# EAGLE design power_control (EAGLE 5.12)

## Sheet 1 of 2
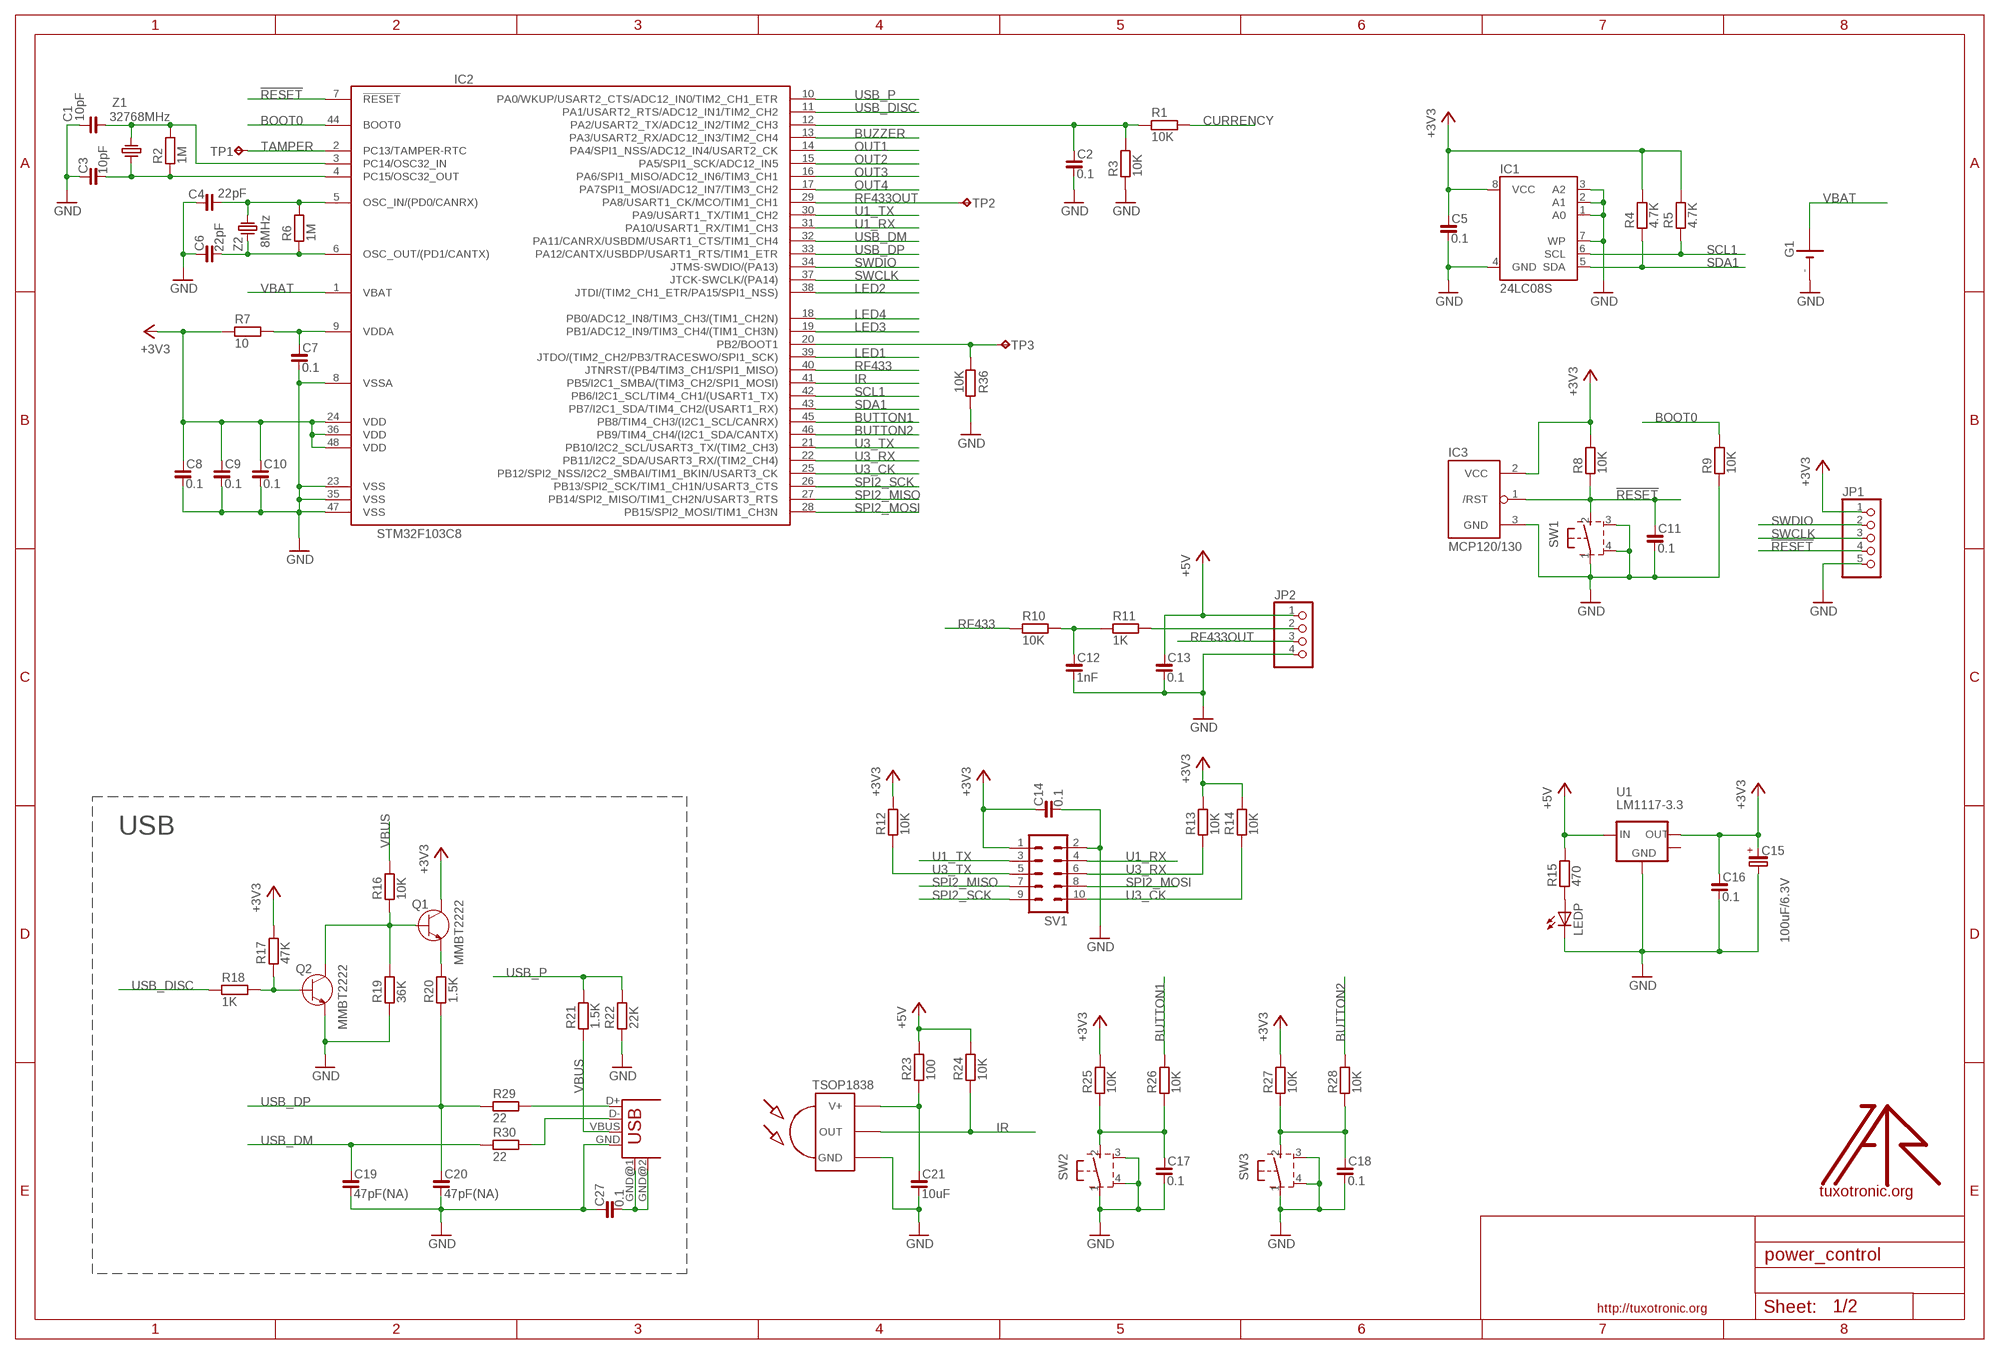
[diagram p0: schematic, sheet 1]

### Parts
C1  10pF  C_0603  [C0603]
C2  0.1  C_0603  [C0603]
C3  10pF  C_0603  [C0603]
C4  22pF  C_0603  [C0603]
C5  0.1  C_0603  [C0603]
C6  22pF  C_0603  [C0603]
C7  0.1  C_0603  [C0603]
C8  0.1  C_0603  [C0603]
C9  0.1  C_0603  [C0603]
C10  0.1  C_0603  [C0603]
C11  0.1  C_0603  [C0603]
C12  1nF  C_0603  [C0603]
C13  0.1  C_0603  [C0603]
C14  0.1  C_0603  [C0603]
C15  100uF/6.3V  CP_SMCD  [SMC_D]
C16  0.1  C_0805  [C0805]
C17  0.1  C_0603  [C0603]
C18  0.1  C_0603  [C0603]
C19  47pF(NA)  C_0603  [C0603]
C20  47pF(NA)  C_0603  [C0603]
C21  10uF  C_0603  [C0603]
C27  0.1  C_1206  [C1206]
G1  LI3VHOLDER  [LITHOLDER]
IC1  24LC08S  AT24C256S  [SO08]
IC2  STM32F103C8  [LQFP48]
IC3  MCP120/130  [SOT23]
IR1  TSOP1838  [TSOP18XX]
JP1  PINHD-1X5_2.00  [1X05M]
JP2  PINHD-1X4_2.54  [1X04]
LEDP  LEDCHIPLED_0805  [CHIPLED_0805]
Q1  MMBT2222  [SOT23]
Q2  MMBT2222  [SOT23]
R1  10K  R_0603  [R0603]
R2  1M  R_0603  [R0603]
R3  10K  R_0603  [R0603]
R4  4.7K  R_0603  [R0603]
R5  4.7K  R_0603  [R0603]
R6  1M  R_0603  [R0603]
R7  10  R_0603  [R0603]
R8  10K  R_0603  [R0603]
R9  10K  R_0603  [R0603]
R10  10K  R_0603  [R0603]
R11  1K  R_0603  [R0603]
R12  10K  R_0603  [R0603]
R13  10K  R_0603  [R0603]
R14  10K  R_0603  [R0603]
R15  470  R_0603  [R0603]
R16  10K  R_0603  [R0603]
R17  47K  R_0603  [R0603]
R18  1K  R_0603  [R0603]
R19  36K  R_0603  [R0603]
R20  1.5K  R_0603  [R0603]
R21  1.5K  R_0603  [R0603]
R22  22K  R_0603  [R0603]
R23  100  R_0603  [R0603]
R24  10K  R_0603  [R0603]
R25  10K  R_0603  [R0603]
R26  10K  R_0603  [R0603]
R27  10K  R_0603  [R0603]
R28  10K  R_0603  [R0603]
R29  22  R_0603  [R0603]
R30  22  R_0603  [R0603]
R36  10K  R_0603  [R0603]
SV1  ML10  [ML10]
SW1  31-XX  [B3F-31XX]
SW2  31-XX  [B3F-31XX]
SW3  31-XX  [B3F-31XX]
TP1  TPB1,27  [B1,27]
TP2  TPB1,27  [B1,27]
TP3  TPB1,27  [B1,27]
U1  LM1117-3.3  [SOT223]
U$1  LOGO  [TT_LOGO]
USB1  USB-B-H  [USB-B-H]
Z1  32768MHz  CRYSTAL-TC26H  [TC26H]
Z2  8MHz  CRYSTAL-HC49S  [HC49/S]

### Nets
!RESET: C11.1 IC2.7(!RESET) IC3.1(/RST) JP1.4 R8.1 SW1.2(S)
+3V3: C5.1 C8.1 C9.1 C10.1 C14.1 C15.+ C16.1 IC1.8(VCC) IC2.24(VDD) IC2.36(VDD) IC2.48(VDD) IC3.2(VCC) JP1.1 Q1.3(C) R4.2 R5.2 R7.1 R8.2 R12.2 R13.2 R14.2 R17.2 R25.2 R27.2 SV1.1 U1.2(OUT)
+5V: C13.1 JP2.1 R15.2 R23.2 R24.2 U1.3(IN) ; also sheet 2
BOOT0: IC2.44(BOOT0) R9.2
BUTTON1: IC2.45(PB8/TIM4_CH3/(I2C1_SCL/CANRX)) R26.2
BUTTON2: IC2.46(PB9/TIM4_CH4/(I2C1_SDA/CANTX)) R28.2
BUZZER: IC2.13(PA3/USART2_RX/ADC12_IN3/TIM2_CH4) ; also sheet 2
CURRENCY: R1.2 ; also sheet 2
GND: C1.1 C2.2 C3.1 C4.1 C5.2 C6.1 C7.2 C8.2 C9.2 C10.2 C11.2 C12.2 C13.2 C14.2 C15.- C16.2 C17.2 C18.2 C19.2 C20.2 C21.2 C27.1 G1.- IC1.1(A0) IC1.2(A1) IC1.3(A2) IC1.4(GND) IC1.7(WP) IC2.8(VSSA) IC2.23(VSS) IC2.35(VSS) IC2.47(VSS) IC3.3(GND) IR1.GND JP1.5 JP2.4 LEDP.C Q2.2(E) R3.1 R9.1 R19.1 R22.1 R36.2 SV1.2 SW1.1(P) SW1.3(GND1) SW1.4(GND2) SW2.1(P) SW2.3(GND1) SW2.4(GND2) SW3.1(P) SW3.3(GND1) SW3.4(GND2) U1.1(GND) USB1.GND ; also sheet 2
IR: IC2.41(PB5/I2C1_SMBA/(TIM3_CH2/SPI1_MOSI)) IR1.OUT R24.1
LED1: IC2.39(JTDO/(TIM2_CH2/PB3/TRACESWO/SPI1_SCK)) ; also sheet 2
LED2: IC2.38(JTDI/(TIM2_CH1_ETR/PA15/SPI1_NSS)) ; also sheet 2
LED3: IC2.19(PB1/ADC12_IN9/TIM3_CH4/(TIM1_CH3N)) ; also sheet 2
LED4: IC2.18(PB0/ADC12_IN8/TIM3_CH3/(TIM1_CH2N)) ; also sheet 2
N$1: IC2.20(PB2/BOOT1) R36.1 TP3.PP(TP)
N$7: C7.1 IC2.9(VDDA) R7.2
N$8: C3.2 IC2.4(PC15/OSC32_OUT) R2.1 Z1.1
N$9: C1.2 IC2.3(PC14/OSC32_IN) R2.2 Z1.2
N$16: C4.2 IC2.5(OSC_IN/(PD0/CANRX)) R6.2 Z2.2
N$28: C2.1 IC2.12(PA2/USART2_TX/ADC12_IN2/TIM2_CH3) R1.1 R3.2
N$29: C21.1 IR1.VCC(V+) R23.1
N$30: C27.2 USB1.GND@1(GND) USB1.GND@2(GND)
N$31: C17.1 R25.1 R26.1 SW2.2(S)
N$32: JP2.2 R11.2
N$33: C18.1 R27.1 R28.1 SW3.2(S)
N$34: C12.1 R10.2 R11.1
N$36: Q1.2(E) R20.2
N$37: Q1.1(B) Q2.3(C) R16.1 R19.2
N$38: Q2.1(B) R17.1 R18.2
N$39: R29.2 USB1.D+
N$40: R30.2 USB1.D-
N$46: LEDP.A R15.1
OUT1: IC2.14(PA4/SPI1_NSS/ADC12_IN4/USART2_CK) ; also sheet 2
OUT2: IC2.15(PA5/SPI1_SCK/ADC12_IN5) ; also sheet 2
OUT3: IC2.16(PA6/SPI1_MISO/ADC12_IN6/TIM3_CH1) ; also sheet 2
OUT4: IC2.17(PA7SPI1_MOSI/ADC12_IN7/TIM3_CH2) ; also sheet 2
RF433: IC2.40(JTNRST/(PB4/TIM3_CH1/SPI1_MISO)) R10.1
RF433OUT: IC2.29(PA8/USART1_CK/MCO/TIM1_CH1) JP2.3 TP2.PP(TP)
SCL1: IC1.6(SCL) IC2.42(PB6/I2C1_SCL/TIM4_CH1/(USART1_TX)) R5.1
SDA1: IC1.5(SDA) IC2.43(PB7/I2C1_SDA/TIM4_CH2/(USART1_RX)) R4.1
SPI2_MISO: IC2.27(PB14/SPI2_MISO/TIM1_CH2N/USART3_RTS) SV1.7
SPI2_MOSI: IC2.28(PB15/SPI2_MOSI/TIM1_CH3N) SV1.8
SPI2_SCK: IC2.26(PB13/SPI2_SCK/TIM1_CH1N/USART3_CTS) SV1.9
SWCLK: IC2.37(JTCK-SWCLK/(PA14)) JP1.3
SWDIO: IC2.34(JTMS-SWDIO/(PA13)) JP1.2
TAMPER: IC2.2(PC13/TAMPER-RTC) TP1.PP(TP)
U1_RX: IC2.31(PA10/USART1_RX/TIM1_CH3) SV1.4
U1_TX: IC2.30(PA9/USART1_TX/TIM1_CH2) SV1.3
U3_CK: IC2.25(PB12/SPI2_NSS/I2C2_SMBAI/TIM1_BKIN/USART3_CK) R14.1 SV1.10
U3_RX: IC2.22(PB11/I2C2_SDA/USART3_RX/(TIM2_CH4)) R13.1 SV1.6
U3_TX: IC2.21(PB10/I2C2_SCL/USART3_TX/(TIM2_CH3)) R12.1 SV1.5
USB_DISC: IC2.11(PA1/USART2_RTS/ADC12_IN1/TIM2_CH2) R18.1
USB_DM: C19.1 IC2.32(PA11/CANRX/USBDM/USART1_CTS/TIM1_CH4) R30.1
USB_DP: C20.1 IC2.33(PA12/CANTX/USBDP/USART1_RTS/TIM1_ETR) R20.1 R29.1
USB_P: IC2.10(PA0/WKUP/USART2_CTS/ADC12_IN0/TIM2_CH1_ETR) R21.2 R22.2
VBAT: G1.+ IC2.1(VBAT)
VBUS: R16.2 R21.1 USB1.VBUS
XTAL2: C6.2 IC2.6(OSC_OUT/(PD1/CANTX)) R6.1 Z2.1
Unconnected: U1.4(MASS)

### Notes on the sheet
- USB

## Sheet 2 of 2
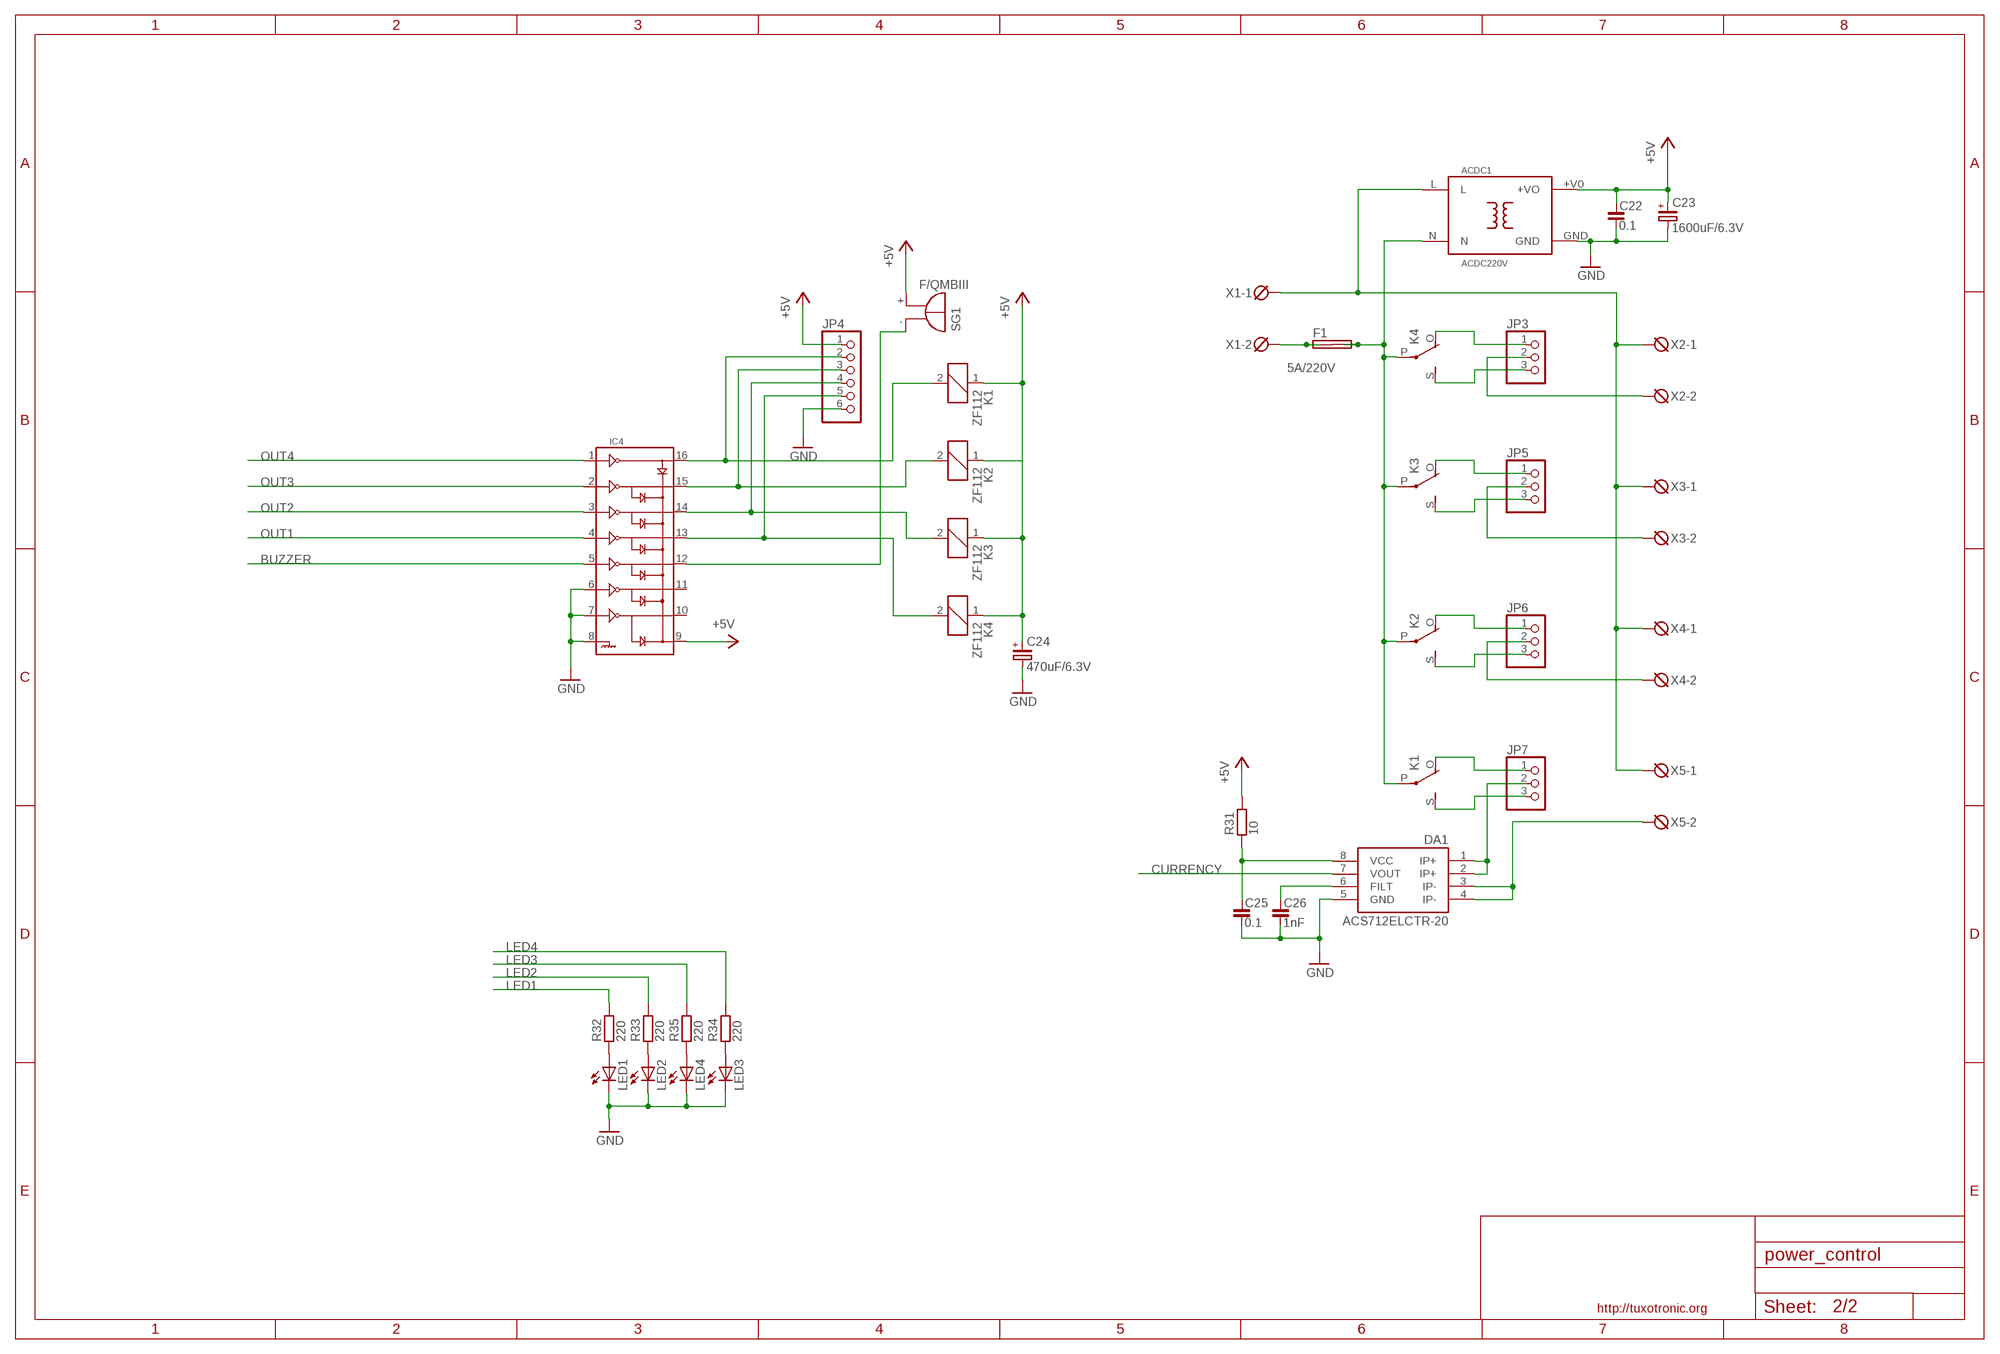
[diagram p1: schematic, sheet 2]

### Parts
ACDC1  ACDC220V  [ACDC600MA]
C22  0.1  C_0805  [C0805]
C23  1600uF/6.3V  CP_E-050X120  [CE-050X120]
C24  470uF/6.3V  CP_E-050X120  [CE-050X120]
C25  0.1  C_0603  [C0603]
C26  1nF  C_0603  [C0603]
DA1  ACS712ELCTR-20  ACS712  [SO08]
F1  5A/220V  SHK20L  [SHK20L]
IC4  ULN2003D  [SO16]
JP3  PINHD-1X3_2.54  [1X03]
JP4  PINHD-1X6_2.54  [1X06]
JP5  PINHD-1X3_2.54  [1X03]
JP6  PINHD-1X3_2.54  [1X03]
JP7  PINHD-1X3_2.54  [1X03]
K1  ZF112  [ZF112]
K2  ZF112  [ZF112]
K3  ZF112  [ZF112]
K4  ZF112  [ZF112]
LED1  LEDCHIPLED_0805  [CHIPLED_0805]
LED2  LEDCHIPLED_0805  [CHIPLED_0805]
LED3  LEDCHIPLED_0805  [CHIPLED_0805]
LED4  LEDCHIPLED_0805  [CHIPLED_0805]
R31  10  R_0603  [R0603]
R32  220  R_0603  [R0603]
R33  220  R_0603  [R0603]
R34  220  R_0603  [R0603]
R35  220  R_0603  [R0603]
SG1  F/QMBIII  [F/QMBIII]
X1  DG3XX-02-5.0  [DG306-5.0-02P]
X2  DG3XX-02-5.0  [DG306-5.0-02P]
X3  DG3XX-02-5.0  [DG306-5.0-02P]
X4  DG3XX-02-5.0  [DG306-5.0-02P]
X5  DG3XX-02-5.0  [DG306-5.0-02P]

### Nets
+5V: ACDC1.+V0(+VO) C22.1 C23.+ C24.+ IC4.9 JP4.1 K1.1 K2.1 K3.1 K4.1 R31.2 SG1.+(-) ; also sheet 1
BUZZER: IC4.5 ; also sheet 1
CURRENCY: DA1.7(VOUT) ; also sheet 1
GND: ACDC1.GND C22.2 C23.- C24.- C25.2 C26.2 DA1.5(GND) IC4.6 IC4.7 IC4.8 JP4.6 LED1.C LED2.C LED3.C LED4.C ; also sheet 1
LED1: R32.2 ; also sheet 1
LED2: R33.2 ; also sheet 1
LED3: R35.2 ; also sheet 1
LED4: R34.2 ; also sheet 1
N$2: LED1.A R32.1
N$3: F1.1A F1.1B X1.2
N$4: JP3.1 K4.O(2:O)
N$5: JP3.3 K4.S(2:S)
N$6: JP5.1 K3.O(2:O)
N$10: IC4.13 JP4.5 K4.2
N$11: IC4.14 JP4.4 K3.2
N$12: IC4.15 JP4.3 K2.2
N$13: JP5.3 K3.S(2:S)
N$14: JP6.1 K2.O(2:O)
N$15: JP6.3 K2.S(2:S)
N$17: JP7.1 K1.O(2:O)
N$18: JP7.3 K1.S(2:S)
N$19: DA1.3(IP-) DA1.4(IP-) X5.2
N$20: JP6.2 X4.2
N$21: JP5.2 X3.2
N$22: JP3.2 X2.2
N$23: DA1.1(IP+) DA1.2(IP+) JP7.2
N$24: C26.1 DA1.6(FILT)
N$25: C25.1 DA1.8(VCC) R31.1
N$26: IC4.16 JP4.2 K1.2
N$27: IC4.12 SG1.-(+)
N$35: ACDC1.N F1.2A F1.2B K1.P(2:P) K2.P(2:P) K3.P(2:P) K4.P(2:P)
N$41: ACDC1.L X1.1 X2.1 X3.1 X4.1 X5.1
N$43: LED2.A R33.1
N$44: LED3.A R34.1
N$45: LED4.A R35.1
OUT1: IC4.4 ; also sheet 1
OUT2: IC4.3 ; also sheet 1
OUT3: IC4.2 ; also sheet 1
OUT4: IC4.1 ; also sheet 1
Unconnected: IC4.10 IC4.11

## Library data of the parts
ACDC1 = dcdc-isolated:ACDC220V: input Input Voltage: AC86 ~ 264V Frequency: 47 ~ 440Hz Impact of current: 16A/AC220V Output Output voltage: 5V, linear adjustment >1% Out current: 0.6A Output voltage (mVP-P): Ripple and noise <1% Temperature coefficient: +-0.2% maintain time 20ms
C1-C14 C16-C22 C25-C27 = rc-master-smd:C_: NON-POLARIZED CAP
C15 = rc-master-smd:CP_: POLARIZED CAP
C23 C24 = rc-master:CP_: POLARIZED CAP
DA1 = SparkFun:ACS712
F1 = fuse:SHK20L: FUSE HOLDER 5 x 20 mm, SH contact, SHH1 Schukat, E1073 Buerklin
G1 = battery:LI3VHOLDER
IC1 = stm32-by-pb:AT24C*: 2-wire serial EEPROM
IC2 = stm32:STM32F103C
IC3 = mcp120-130:MCP120/130
IC4 = transistor-arrays:ULN2003: OUTPUT CURRENT 500mA PER DRIVER (600mA PEAK) OUTPUT VOLTAGE 50V
IR1 = tsop-1:TSOP1838: IR Receiver and Demodulator
JP1 = pinhead-fixdrills:PINHD-1X5: PIN HEADER
JP2 = pinhead-fixdrills:PINHD-1X4: PIN HEADER
JP3 JP5-JP7 = pinhead-fixdrills:PINHD-1X3: PIN HEADER
JP4 = pinhead-fixdrills:PINHD-1X6: PIN HEADER
K1-K4 = myrelays:ZF112: RELAY 1 x switch
LED1-LED4 LEDP = led:LED: LED OSRAM: - CHIPLED LG R971, LG N971, LY N971, LG Q971, LY Q971, LO R971, LY R971 LH N974, LH R974 LS Q976, LO Q976, LY Q976 LO Q996 - Hyper CHIPLED LW Q18S LB Q993, LB Q99A, LB R99A - SideLED LS A670, LO A670, LY A670, LG A670, LP A670 LB A673, LV A673, LT A673, LW A673 LH A674 LY A675 LS A676, LA A676, LO A676, LY A676, LW A676 LS A679, LY A679, LG A679 - Hyper Micro SIDELED® LS Y876, LA Y876, LO Y876, LY Y876 LT Y87S - SmartLED LW L88C, LW L88S LB L89C, LB L89S, LG L890 LS L89K, LO L89K, LY L89K LS L896, LA L896, LO L896, LY L896 - TOPLED LS T670, LO T670, LY T670, LG T670, LP T670 LSG T670, LSP T670, LSY T670, LOP T670, LYG T670 LG T671, LOG T671, LSG T671 LB T673, LV T673, LT T673, LW T673 LH T674 LS T676, LA T676, LO T676, LY T676, LB T676, LH T676, LSB T676, LW T676 LB T67C, LV T67C, LT T67C, LS T67K, LO T67K, LY T67K, LW E67C LS E67B, LA E67B, LO E67B, LY E67B, LB E67C, LV E67C, LT E67C LW T67C LS T679, LY T679, LG T679 LS T770, LO T770, LY T770, LG T770, LP T770 LB T773, LV T773, LT T773, LW T773 LH T774 LS E675, LA E675, LY E675, LS T675 LS T776, LA T776, LO T776, LY T776, LB T776 LHGB T686 LT T68C, LB T68C - Hyper Mini TOPLED® LB M676 - Mini TOPLED Santana® LG M470 LS M47K, LO M47K, LY M47K Source: http://www.osram.convergy.de - LUMILED® LXK2-PW12-R00, LXK2-PW12-S00, LXK2-PW14-U00, LXK2-PW14-V00 LXK2-PM12-R00, LXK2-PM12-S00, LXK2-PM14-U00 LXK2-PE12-Q00, LXK2-PE12-R00, LXK2-PE12-S00, LXK2-PE14-T00, LXK2-PE14-U00 LXK2-PB12-K00, LXK2-PB12-L00, LXK2-PB12-M00, LXK2-PB14-N00, LXK2-PB14-P00, LXK2-PB14-Q00 LXK2-PR12-L00, LXK2-PR12-M00, LXK2-PR14-Q00, LXK2-PR14-R00 LXK2-PD12-Q00, LXK2-PD12-R00, LXK2-PD12-S00 LXK2-PH12-R00, LXK2-PH12-S00 LXK2-PL12-P00, LXK2-PL12-Q00, LXK2-PL12-R00 Source: www.luxeon.com
Q1 Q2 = semiconductor:MMBT2222: General Purpose Transistors NPN Silicon Rating MMBT2222LT1G MMBT2222ALT1G Collector-Emitter Voltage (VCEO) 30 Vdc 40 Vdc Collector-Base Voltage (VCBO) 60 Vdc 75 Vdc Emitter-Base Voltage (VEBO) 5.0 Vdc 6.0 Vdc Collector Current Continuous (IC) 600 mAdc 1100 mAdc Collector Current Peak (ICM) 600 mAdc 1100 mAdc
R1-R36 = rc-master-smd:R_: RESISTOR
SG1 = buzzer:F/QMBIII: BUZZER Source: Buerklin
SV1 = con-ml:ML10: HARTING
SW1-SW3 = buttons:31-XX: OMRON SWITCH
TP1-TP3 = testpad:TP: Test pad
U1 = vreg-linear:LM1117: Linear regulators
U$1 = logo:LOGO
USB1 = usb:USB: USB Connectors
X1-X5 = degson:DG3XX-02: DG350-3.5-02P DG306-5.0-02P
Z1 Z2 = discrete:CRYSTAL-: CRYSTAL

## Board
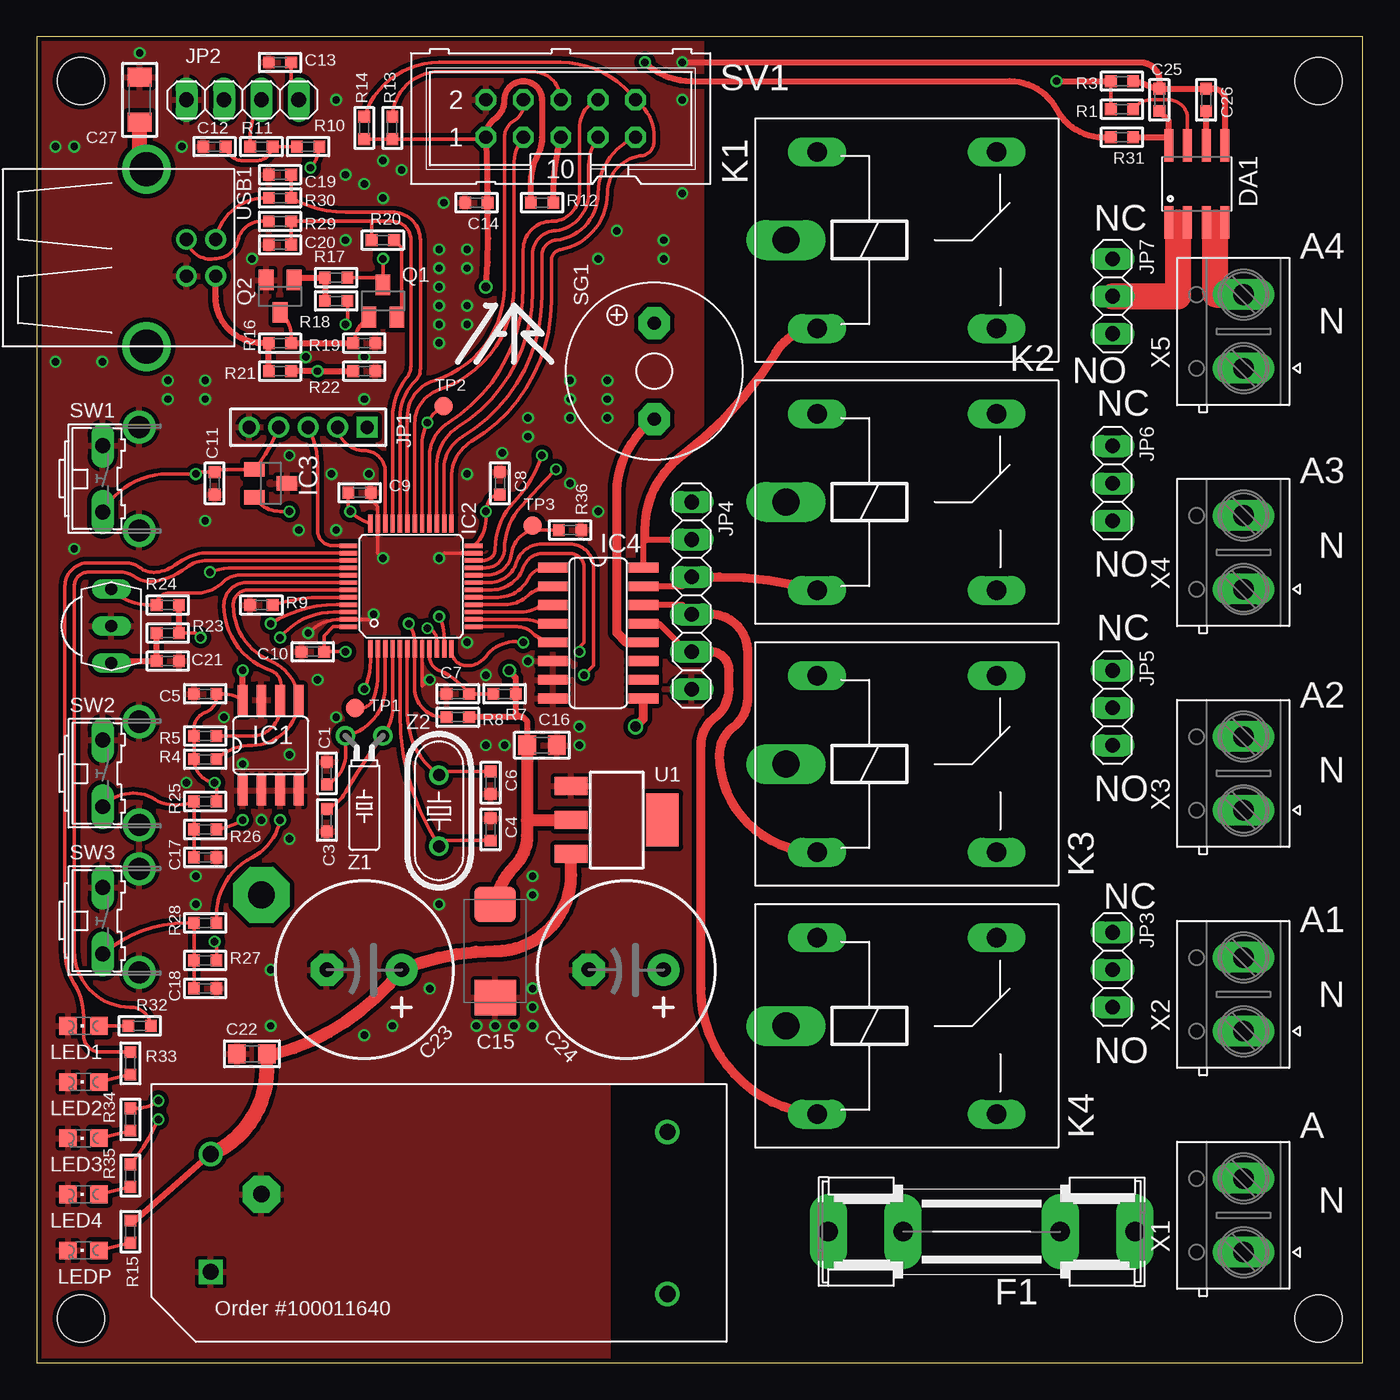
[diagram p2: board, top side]
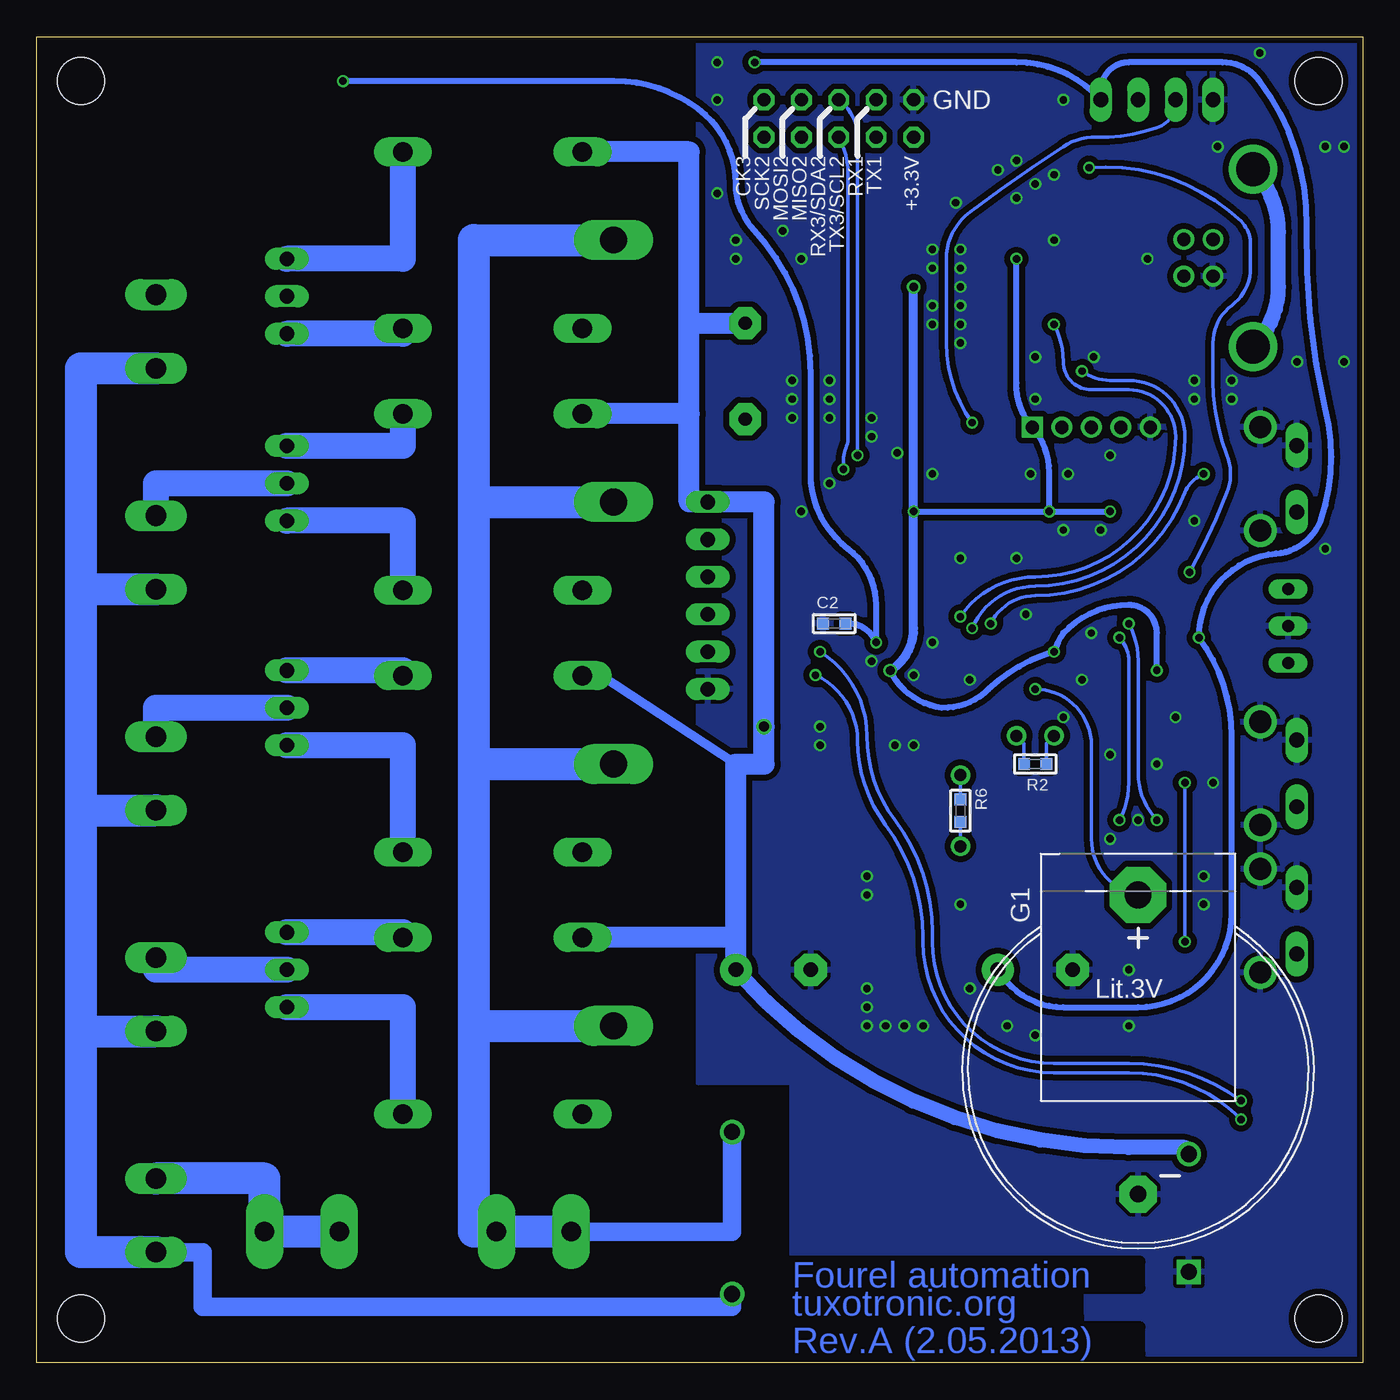
[diagram p3: board, bottom side, seen from below]

Size 90 x 90 mm. Coordinates in mm from the lower left corner, seen from the top.
Outline: 0,0 90,0 90,90 0,90 0,0
Copper layers (1*16): Top 0.035mm / dielectric 1.5mm / Bottom 0.035mm
Design rules "ITEADstudio_DRC": minimum track width 6mil, minimum drill 12mil, track to track 6mil, track to pad 6mil, pad to pad 6mil, via to via 6mil, smd to smd 0mil, copper to edge 10mil, drill to drill 10mil, minimum pad ring 10mil, minimum via ring 6mil, stop-mask expansion 2mil, vias tented up to drill 100mil, thermal gap 10mil
Holes 3.2 mm at 87,3 3,3 3,87 87,87

### Footprints (pad centres in the part's own frame; a part is rotated, then mirrored left to right if it is on the bottom)
ACDC600MA = drill 1.1 round: +V0 -15.5,4; L 15.5,-5.5; N 15.5,5.5 | drill 1.1 square: GND -15.5,-4
C0603 = smd 0.8 x 0.8: 1 -0.762,0; 2 0.762,0
SMC_D = smd 2.4 x 2.8: + -3.15,0; - 3.15,0
C0805 = smd 1.2 x 1.3: 1 -1.016,0; 2 1.016,0
CE-050X120 = drill 1 pad 2.184 round: + -2.54,0 | drill 1 pad 2.184 octagon: - 2.54,0
C1206 = smd 1.3 x 1.6: 1 -1.524,0; 2 1.524,0
SO08 = smd 0.61 x 2.21: 1 -1.905,-2.616; 2 -0.635,-2.616; 3 0.635,-2.616; 4 1.905,-2.616; 5 1.905,2.616; 6 0.635,2.616; 7 -0.635,2.616; 8 -1.905,2.616
SHK20L = drill 1.321 pad 2.54 long: 1A -10.414,0; 1B -5.334,0; 2A 10.414,0; 2B 5.334,0
LITHOLDER = drill 1.803 pad 3.81 octagon: + 0,12.065 | drill 1.118 pad 2.54 octagon: - 0,-8.255
SO08' = smd 0.66 x 2.032: 1 -1.905,-3.073; 2 -0.635,-3.073; 3 0.635,-3.073; 4 1.905,-3.073; 5 1.905,3.073; 6 0.635,3.073; 7 -0.635,3.073; 8 -1.905,3.073
LQFP48 = smd 0.3 x 1.2: 1 -2.75,-4.25; 2 -2.25,-4.25; 3 -1.75,-4.25; 4 -1.25,-4.25; 5 -0.75,-4.25; 6 -0.25,-4.25; 7 0.25,-4.25; 8 0.75,-4.25; 9 1.25,-4.25; 10 1.75,-4.25; 11 2.25,-4.25; 12 2.75,-4.25; 25 2.75,4.25; 26 2.25,4.25; 27 1.75,4.25; 28 1.25,4.25; 29 0.75,4.25; 30 0.25,4.25; 31 -0.25,4.25; 32 -0.75,4.25; 33 -1.25,4.25; 34 -1.75,4.25; 35 -2.25,4.25; 36 -2.75,4.25 | smd 1.2 x 0.3: 13 4.25,-2.75; 14 4.25,-2.25; 15 4.25,-1.75; 16 4.25,-1.25; 17 4.25,-0.75; 18 4.25,-0.25; 19 4.25,0.25; 20 4.25,0.75; 21 4.25,1.25; 22 4.25,1.75; 23 4.25,2.25; 24 4.25,2.75; 37 -4.25,2.75; 38 -4.25,2.25; 39 -4.25,1.75; 40 -4.25,1.25; 41 -4.25,0.75; 42 -4.25,0.25; 43 -4.25,-0.25; 44 -4.25,-0.75; 45 -4.25,-1.25; 46 -4.25,-1.75; 47 -4.25,-2.25; 48 -4.25,-2.75
SOT23 = smd 1 x 1.4: 1 -0.95,-1.1; 2 0.95,-1.1; 3 0,1.1
SO16 = smd 0.66 x 2.032: 1 -4.445,-3.073; 2 -3.175,-3.073; 3 -1.905,-3.073; 4 -0.635,-3.073; 5 0.635,-3.073; 6 1.905,-3.073; 7 3.175,-3.073; 8 4.445,-3.073; 9 4.445,3.073; 10 3.175,3.073; 11 1.905,3.073; 12 0.635,3.073; 13 -0.635,3.073; 14 -1.905,3.073; 15 -3.175,3.073; 16 -4.445,3.073
TSOP18XX = drill 0.813 long: GND -0.001,-0.027; OUT -2.501,-0.027; VCC 2.499,-0.027
1X05M = drill 0.9 square: 1 -4,0 | drill 0.9 round: 2 -2,0; 3 0,0; 4 2,0; 5 4,0
1X04 = drill 1 long: 1 -3.81,0; 2 -1.27,0; 3 1.27,0; 4 3.81,0
1X03 = drill 1 long: 1 -2.54,0; 2 0,0; 3 2.54,0
1X06 = drill 1 long: 1 -6.35,0; 2 -3.81,0; 3 -1.27,0; 4 1.27,0; 5 3.81,0; 6 6.35,0
ZF112 = drill 1.321 long: 1 -6.096,5.994; 2 -6.096,-5.994; O 6.096,5.994; S 6.096,-5.994 | drill 1.803 long: P -8.204,0
CHIPLED_0805 = smd 1.2 x 1.2: A 0,-1.05; C 0,1.05
R0603 = smd 0.8 x 0.8: 1 -0.762,0; 2 0.762,0
F/QMBIII = drill 0.9 pad 2.159 octagon: + 3.251,0; - -3.251,0
ML10 = drill 0.9 octagon: 1 -5.08,-1.27; 2 -5.08,1.27; 3 -2.54,-1.27; 4 -2.54,1.27; 5 0,-1.27; 6 0,1.27; 7 2.54,-1.27; 8 2.54,1.27; 9 5.08,-1.27; 10 5.08,1.27
B3F-31XX = drill 1.016 long: 1 -2.261,-1.245; 2 2.261,-1.245 | drill 1.499 pad 2.159 round: 3 -3.505,1.245; 4 3.505,1.245
B1,27 = smd 1.27 x 1.27: PP 0,0
SOT223 = smd 1.219 x 2.235: 1 -2.311,-3.099; 2 0,-3.099; 3 2.311,-3.099 | smd 3.6 x 2.2: 4 0,3.099
USB-B-H = drill 0.9 round: D+ 0,1.25; D- 1.981,1.25; GND 0,-1.25; VBUS 1.981,-1.25 | drill 2.3 round: GND@1 -2.718,6.02; GND@2 -2.718,-6.02
DG306-5.0-02P = drill 1.4 long: 1 -2.5,0; 2 2.5,0
TC26H = drill 0.813 round: 1 -1.27,0; 2 1.27,0
HC49/S = drill 0.813 round: 1 -2.413,0; 2 2.413,0

### Placement (x,y rotation side)
ACDC1  27.3,10.16 0 top
C1  19.68,40.01 270 top
C2  35.88,50.16 180 bottom
C3  19.68,36.83 90 top
C4  30.8,36.2 270 top
C5  11.43,45.4 180 top
C6  30.8,39.37 90 top
C7  28.57,45.4 180 top
C8  31.43,59.69 90 top
C9  21.91,59.05 0 top
C10  18.73,48.26 180 top
C11  12.06,59.69 270 top
C12  12.06,82.55 180 top
C13  16.51,88.27 180 top
C14  29.84,78.74 180 top
C15  31.11,27.94 270 top
C16  34.29,41.91 0 top
C17  11.43,34.29 0 top
C18  11.43,25.4 0 top
C19  16.51,80.64 180 top
C20  16.51,75.88 180 top
C21  8.89,47.62 0 top
C22  14.61,20.95 180 top
C23  22.23,26.67 180 top
C24  40.01,26.67 180 top
C25  76.2,85.72 90 top
C26  79.38,85.72 90 top
C27  6.99,85.72 270 top
DA1  78.74,80.01 0 top
F1  64.14,8.89 180 top
G1  15.24,19.68 0 bottom
IC1  24LC08S  [SO08']  15.88,41.91 0 top
IC2  25.4,52.7 0 top
IC3  15.88,59.69 270 top
IC4  38.1,49.53 270 top
IR1  5.08,50 270 top
JP1  18.41,63.5 180 top
JP2  13.97,85.72 180 top
JP3  73.03,26.67 270 top
JP4  44.45,52.07 270 top
JP5  73.03,44.45 270 top
JP6  73.03,59.69 270 top
JP7  73.03,72.39 270 top
K1  59.05,76.2 0 top
K2  59.05,58.42 0 top
K3  59.05,40.64 0 top
K4  59.05,22.86 0 top
LED1  3.17,22.86 90 top
LED2  3.17,19.05 90 top
LED3  3.17,15.24 90 top
LED4  3.17,11.43 90 top
LEDP  3.17,7.62 90 top
Q1  23.5,72.07 0 top
Q2  16.51,72.39 180 top
R1  73.66,85.09 0 top
R2  22.23,40.64 0 bottom
R3  73.66,87 180 top
R4  11.43,40.96 180 top
R5  11.43,42.55 180 top
R6  27.3,37.47 270 bottom
R7  31.75,45.4 180 top
R8  28.57,43.81 0 top
R9  15.24,51.44 0 top
R10  18.41,82.55 180 top
R11  15.24,82.55 180 top
R12  34.29,78.74 180 top
R13  24.13,83.82 270 top
R14  22.23,83.82 270 top
R15  6.35,8.89 90 top
R16  16.51,69.22 180 top
R17  20.32,73.66 0 top
R18  20.32,72.07 180 top
R19  22.23,69.22 180 top
R20  23.5,76.2 0 top
R21  16.51,67.31 0 top
R22  22.23,67.31 180 top
R23  8.89,49.53 0 top
R24  8.89,51.44 0 top
R25  11.43,38.1 0 top
R26  11.43,36.2 0 top
R27  11.43,27.3 0 top
R28  11.43,29.84 0 top
R29  16.51,77.47 180 top
R30  16.51,79.06 180 top
R31  73.66,83.19 180 top
R32  6.99,22.86 0 top
R33  6.35,20.32 90 top
R34  6.35,16.51 90 top
R35  6.35,12.7 90 top
R36  36.2,56.52 0 top
SG1  41.91,67.31 90 top
SV1  35.56,84.45 0 top
SW1  5.71,60 270 top
SW2  5.71,40 270 top
SW3  5.71,30 270 top
TP1  21.59,44.45 0 top
TP2  27.62,64.93 0 top
TP3  33.66,56.83 0 top
U1  39.37,36.83 270 top
U$1  32.38,70.48 0 top
USB1  10.16,75 0 top
X1  81.92,10 90 top
X2  81.92,25 90 top
X3  81.92,40 90 top
X4  81.92,55 90 top
X5  81.92,70 90 top
Z1  22.23,42.55 180 top
Z2  27.3,37.47 270 top

### Tracks (layer width: path | path; a pad name or v marks a point on that pad's centre or on a via)
!RESET  (via drill 0.5)
  Top 0.254: JP1.4 16.1,62.77 arc-17 IC3.1 12.06,60.64 C11.1 10.92,60.45 v10.79,60.33 8.89,60.33 arc61 SW1.2 | R8.1 27.62,43.81 arc-90 25.65,45.79 IC2.7 25.65,48.96 arc38 v25.24,50.16
  Bottom 0.254: v10.79,60.33 arc-48 12.06,59.05 arc69 22.23,52.07 arc-65 v25.24,50.16
+3V3  (via drill 0.5, 0.6)
  Top 0.254: R14.2 R13.2 30.35,83.06 SV1.1 | R27.2 12.19,28.45 v12.06,28.57 | R25.2 12.19,39.24 v12.06,39.37 arc-83 R4.2 R5.2 10.67,43.05 arc-70 11.43,44.13 arc79 C5.1 12.6,45.4 arc-34 IC1.8 | C9.1 21.14,57.91 v21.27,57.78 arc28 IC2.36 | IC2.48 20.11,49.95 19.49,49.34 C10.1 v20.95,48.26 | v23.5,74.93 Q1.3 23.01,73.66 R17.2 | v17.14,57.78 16.51,57.78 arc-58 IC3.2 | C8.1 arc77 30.61,58.29 v30.48,57.78 30.48,57.15 arc-52 IC2.24
  Top 0.406: R12.2 33.53,80.2 arc-27 33.97,81.92 arc28 34.29,83.19 34.29,85.72 arc90 33.02,87 arc90 31.75,85.72 arc-53 31.11,84.45 arc53 SV1.1 arc-4 30.61,79.5 C14.1 30.61,77.98 arc-8 v30.48,73.03 | v32.07,46.99 32.51,46.48 R7.1 32.51,44.01 33.02,43.81 | 33.02,43.81 R8.2 | C16.1 33.27,43.56 33.02,43.81 | IC1.8 v13.97,46.99
  Top 0.813: C16.1 33.27,36.83 | 33.27,36.83 U1.2 | 33.27,36.83 33.27,35.77 arc-46 32.38,33.66 arc38 C15.+
  Bottom 0.254: v12.06,28.57 v12.06,39.37
  Bottom 0.406: v21.27,57.78 v17.14,57.78 | v21.27,57.78 21.27,60.45 arc-41 JP1.1 arc43 23.5,66.52 v23.5,74.93 | v30.48,57.78 v21.27,57.78 | v13.97,46.99 13.97,49.53 arc-90 15.88,51.44 arc-46 20.32,49.53 arc-13 v20.95,48.26 arc-27 25.4,45.72 arc46 28.57,44.45 arc57 v32.07,46.99
  Bottom 0.61: v30.48,73.03 v30.48,57.78 30.48,49.85 arc58 v32.07,46.99
+5V  (via drill 0.5, 0.7)
  Top 0.254: C13.1 17.27,86.23 JP2.1 | R23.2 10.79,49.53 v11.11,49.21
  Top 0.406: R23.2 R24.2 | R15.2 6.66,9.65 ACDC1.+V0 | R31.2 72.39,83.19 arc-62 69.22,85.09 arc62 66.04,87 44.45,87 arc-44 v41.27,88.27
  Top 0.61: IC4.9 41.17,43.71 v40.64,43.18
  Top 0.813: 15.62,19.94 C22.1 16.19,20.95 arc36 C23.+ arc-23 31.11,27.94 arc90 36.27,33.1 U1.3
  Top 1.016: ACDC1.+V0 arc67 15.62,19.94
  Bottom 0.406: v41.27,88.27 23.5,88.27 arc48 JP2.1 17.78,86.36 arc90 15.88,88.27 9.53,88.27 arc53 6.99,87 arc38 3.81,77.15 arc-14 2.54,64.77 arc34 2.86,57.15 arc64 5.87,54.93 arc-86 v11.11,49.21 arc37 8.89,42.55 8.89,30.48 arc90 15.24,24.13 20.32,24.13 arc59 C23.+
  Bottom 0.61: K3.1 51.71,46.63 42.55,40.64
  Bottom 1.016: ACDC1.+V0 11.8,14.35 12.06,14.61 15.88,14.61 arc49 C24.+
  Bottom 1.422: K1.1 45.72,82.19 45.72,70.56 | 45.72,70.56 SG1.+ | 45.72,64.41 45.72,70.56 | 45.72,64.41 K2.1 | 42.55,28.85 K4.1 | C24.+ 42.55,28.85 | 45.72,64.41 45.72,58.42 JP4.1 40.64,58.42 v40.64,43.18 40.64,40.64 42.55,40.64 42.55,28.85
BOOT0
  Top 0.254: IC2.44 19.57,51.95 arc17 R9.2
BUTTON1  (via drill 0.5)
  Top 0.254: IC2.45 20.34,51.45 arc32 v15.88,50.16 | R26.2 arc24 v13.97,36.83
  Bottom 0.254: v15.88,50.16 arc28 15.24,47.62 15.24,40.01 arc-44 v13.97,36.83
BUTTON2  (via drill 0.5)
  Top 0.254: R28.2 12.19,30.35 arc-63 14.61,34.29 arc52 v16.51,36.83 | IC2.46 20.16,50.95 arc51 v16.51,49.21
  Bottom 0.254: v16.51,49.21 arc44 15.88,47.62 15.88,39.37 arc28 v16.51,36.83
BUZZER
  Top 0.254: IC2.13 32.59,49.95 arc-44 33.66,49.53 arc38 IC4.5
CURRENCY
  Top 0.254: DA1.7 78.11,84.45 arc90 76.83,85.72 75.69,85.72 arc53 R1.2
GND  (via drill 0.5)
  Top 0.254: C9.2 22.67,58.61 23.15,58.13 IC2.35 23.15,54.95 v23.5,54.61 | v18.41,49.53 arc-46 20.61,50.45 | IC2.8 26.15,45.92 v26.67,46.35 | IC2.23 27.65,54.95 v27.3,54.61 | IC2.47 22.52,50.45 v22.86,50.8
  Top 0.406: DA1.5 80.64,85.72 arc90 79.88,86.49 C26.2 C25.2 | C25.2 76.2,87 arc90 74.93,88.27 v43.81,88.27 | R3.1 74.61,87 75.91,86.49 C25.2
  other vias: 20.95,76.2 20.95,80.64 20,60.33 22.23,65.41 31.59,61.75 29.21,48.9 19.05,46.35 17.14,35.56 20.32,43.81 17.14,41.27 15.24,36.83 10.79,33.02 13.97,40.64 10.16,39.37 10.79,31.11 22.54,60.33 20.32,56.52 12.7,43.81 27.62,78.74 43.81,85.72 42.55,76.2 42.55,74.93 39.37,76.83 30.48,46.67 33.34,47.62 31.75,41.91 30.48,41.91 36.83,41.91 36.83,43.18 33.66,33.02 38.1,57.78 36.2,59.69 38.73,64.14 36.2,64.14 33.34,64.14 33.34,62.87 27.3,69.22 29.21,60.33 20.32,85.72 14.61,74.93 38.73,65.41 38.73,66.67 36.2,65.41 36.2,66.67 43.81,79.38 33.66,31.75 27.3,31.11 26.67,25.4 33.66,25.4 33.66,24.13 33.66,22.86 32.38,22.86 31.11,22.86 29.84,22.86 24.13,22.86 22.23,22.23 15.88,22.86 15.88,26.67 38.1,74.93 27.3,70.48 27.3,71.75 27.3,73.03 27.3,74.3 27.3,75.56 29.21,70.48 29.21,71.75 29.21,74.3 29.21,75.56 22.23,80.01 23.5,79.06 24.77,80.96 23.5,81.6 8.89,66.67 8.89,65.41 11.43,66.67 11.43,65.41 11.43,57.15 17.78,56.52 17.14,61.59 18.26,68.26 22.23,68.26 9.84,82.55 2.54,82.55 1.27,82.55 6.99,88.9 1.27,67.94 4.45,67.94 2.54,55.24
  pour Bottom (isolate 0.406): -1.27,91.44 45.09,91.44 45.09,19.05 38.73,19.05 38.73,-0.64 -1.27,-0.64
  pour Top (isolate 0.305): -1.27,91.44 45.09,91.44 45.09,19.05 38.73,19.05 38.73,-0.64 -1.27,-0.64
IR
  Top 0.254: IC2.41 13.77,53.45 arc44 12.7,53.02 arc-46 10.64,52.23 arc4 8.89,52.23 arc88 R24.1 7.62,51.44 arc-45 IR1.OUT
LED1
  Top 0.254: IC2.39 11.59,54.45 arc37 10.16,53.98 arc-34 7.78,53.02 arc-42 6.67,53.34 arc37 5.71,53.66 3.49,53.66 arc90 2.54,52.7 2.54,27.94 arc90 6.35,24.13 arc-85 R32.2
LED2
  Top 0.254: IC2.38 11.46,54.95 arc30 10.16,54.61 arc10 9.37,54.13 arc-31 8.1,53.66 arc-42 6.99,53.98 arc37 6.03,54.29 3.49,54.29 arc90 1.91,52.7 1.91,27.94 arc32 2.54,25.72 arc-32 3.17,23.5 3.17,22.23 arc90 4.32,21.08 R33.2
LED3  (via drill 0.5)
  Top 0.254: IC2.19 30.73,52.95 arc73 32.54,54.29 arc-74 34.29,55.56 36.2,55.56 arc-90 37.78,53.98 37.78,47.31 v37.15,46.67 | v8.26,16.51 7.94,15.88 arc-14 R35.2
  Bottom 0.254: v8.26,16.51 arc-45 15.88,19.68 20.95,19.68 arc90 29.84,28.57 29.84,28.89 arc-37 32.38,36.51 arc37 34.29,42.23 arc-65 v37.15,46.67
LED4  (via drill 0.5)
  Top 0.254: IC2.18 30.86,52.45 arc70 33.02,53.98 arc-67 34.29,54.93 36.2,54.93 arc-90 37.15,53.98 37.15,48.9 36.83,48.58 v36.83,48.26 | R34.2 arc44 v8.26,17.78
  Bottom 0.254: v8.26,17.78 arc-37 15.88,20.32 20.95,20.32 arc90 29.21,28.57 29.21,29.21 arc-37 31.75,36.83 arc37 33.66,42.55 arc-58 v36.83,48.26
N$1
  Top 0.254: IC2.20 30.59,53.45 arc84 32.23,54.93 arc-84 33.97,56.52 | 33.97,56.52 arc-1 R36.1 | 33.97,56.52 TP3.PP
N$2
  Top 0.254: LED1.A R32.1
N$3
  Bottom 2.184: F1.1B F1.1A 74.55,12.5 X1.2
N$4
  Bottom 1.778: JP3.1 65.15,29.21 K4.O
N$5
  Bottom 1.778: JP3.3 65.15,24.13 K4.S
N$6
  Bottom 1.778: JP5.1 65.15,46.99 K3.O
N$7
  Top 0.254: R7.2 C7.1 arc32 27.3,46.99 arc-68 26.65,47.96 IC2.9
N$8
  Top 0.254: IC2.4 24.15,44.47 arc-38 Z1.1 arc8 20.95,38.73 arc-36 C3.2
  Bottom 0.254: R2.1 22.99,42.04 Z1.1
N$9
  Top 0.254: IC2.3 23.65,45.88 arc-78 Z1.2 20.95,41.27 arc-64 C1.2
  Bottom 0.254: R2.2 21.46,42.04 Z1.2
N$10
  Top 0.406: IC4.13 42.23,50.16 44.13,48.26 JP4.5
  Top 0.61: JP4.5 45.72,48.26 arc-90 46.99,46.99 46.99,45.72 arc-53 46.04,43.81 arc53 45.09,41.91 45.09,25.4 arc85 K4.2
N$11
  Top 0.406: IC4.14 43.81,51.44 JP4.4
  Top 0.61: JP4.4 45.72,50.8 arc-90 48.26,48.26 48.26,45.09 arc-53 47.31,43.18 arc53 46.35,41.27 arc90 K3.2
N$12
  Top 0.406: IC4.15 43.81,52.7 JP4.3
  Top 0.61: JP4.3 46.33,53.34 arc-16 K2.2
N$13
  Bottom 1.778: JP5.3 65.15,41.91 K3.S
N$14
  Bottom 1.778: JP6.1 65.15,62.23 K2.O
N$15
  Bottom 1.778: JP6.3 65.15,57.15 K2.S
N$16
  Top 0.254: C4.2 27.69,35.43 Z2.2 arc-33 24.65,44.06 IC2.5
  Bottom 0.254: Z2.2 R6.2
N$17
  Bottom 1.778: JP7.1 65.15,74.93 K1.O
N$18
  Bottom 1.778: JP7.3 65.15,69.85 K1.S
N$19
  Top 0.61: DA1.3 80.01,77.39 DA1.4
  Top 1.778: X5.2 80.01,72.5 80.01,77.39
N$20
  Bottom 1.778: JP6.2 81.92,59.69 X4.2
N$21
  Bottom 1.778: JP5.2 81.92,44.45 X3.2
N$22
  Bottom 1.778: JP3.2 81.92,26.67 X2.2
N$23
  Top 0.61: DA1.1 77.47,77.39 DA1.2
  Top 1.778: JP7.2 77.47,72.39 77.47,77.39
N$24
  Top 0.406: DA1.6 C26.1
N$25
  Top 0.406: 76.83,83.19 DA1.8 | 76.83,83.19 76.83,84.33 C25.1 76.07,85.09 | R31.1 76.83,83.19
N$26
  Top 0.406: JP4.2 41.27,55.88 41.17,55.78 IC4.16
  Top 0.61: 41.27,55.88 41.27,56.52 arc-53 43.81,61.59 arc22 50.16,68.58 arc-57 K1.2
N$27
  Top 0.61: IC4.12 40.01,48.9 39.37,49.53 39.37,58.98 arc-53 SG1.-
N$28  (via drill 0.5)
  Top 0.254: R3.2 R1.1 | v33.02,48.9 arc65 30.48,47.94 arc-53 29.21,47.31 arc-95 IC2.12
  Top 0.406: v69.22,87 R3.2
  Bottom 0.406: v69.22,87 50.8,87 arc37 45.09,85.09 arc53 42.55,80.01 arc-42 41.27,76.83 arc43 37.47,67.15 37.47,60.33 arc-53 34.92,55.24 arc53 33.02,51.44 v33.02,48.9 arc-67 34.92,50.16 C2.1
N$29
  Top 0.406: IR1.VCC 5.65,47.62 C21.1 R23.1
N$30
  Top 1.016: C27.2 6.99,81.48 USB1.GND@1
  Bottom 1.016: USB1.GND@1 arc44 5.71,76.75 5.71,73.03 arc46 USB1.GND@2
N$31
  Top 0.254: SW2.2 arc-85 8.26,38.1 arc44 R25.1 R26.1 C17.1
N$32
  Top 0.254: R11.2 14.48,83.06 arc-32 JP2.2
N$33
  Top 0.254: C18.1 R27.1 R28.1 10.16,29.84 arc41 SW3.2
N$34
  Top 0.254: R10.2 R11.1 arc-83 14.92,81.6 13.97,81.6 arc-80 C12.1
N$35
  Bottom 1.27: F1.2A 42.8,8.89 ACDC1.N
  Bottom 2.184: F1.2A F1.2B 60.33,8.89 60.33,22.86 | K1.P 60.33,76.2 60.33,58.42 | 60.33,22.86 60.33,40.64 | 60.33,40.64 60.33,58.42 | 60.33,22.86 K4.P | 60.33,40.64 K3.P | 60.33,58.42 K2.P
N$36
  Top 0.254: Q1.2 24.77,71.61 24.77,75.69 R20.2
N$37
  Top 0.254: R19.2 21.59,69.66 arc-40 Q1.1 | 16.64,71.16 Q2.3 arc-52 17.27,69.72 R16.1
  Top 0.406: R16.1 R19.2
N$38
  Top 0.406: Q2.1 17.63,73.66 R17.1 R18.2
N$39
  Top 0.254: R29.2 15.24,77.47 arc77 13.65,76.2 arc-77 12.06,74.93 arc-87 USB1.D+
N$40
  Top 0.254: R30.2 15.56,79.06 arc80 USB1.D-
N$41
  Bottom 1.27: X1.1 78.74,7.5 78.74,3.81 42.8,3.81 ACDC1.L
  Bottom 2.184: X1.1 87,7.5 87,22.5 | 87,37.5 87,52.5 | 87,22.5 X2.1 | 87,37.5 X3.1 | 87,22.5 87,37.5 | 87,52.5 X4.1 | X5.1 87,67.5 87,52.5
N$43
  Top 0.254: LED2.A R33.1
N$44
  Top 0.254: LED3.A R34.1
N$45
  Top 0.254: LED4.A R35.1
N$46
  Top 0.254: LEDP.A R15.1
OUT1
  Top 0.254: IC2.14 33.05,50.45 arc-26 34.29,50.16 arc53 IC4.4
OUT2
  Top 0.254: IC2.15 32.86,50.95 arc37 34.29,51.44 arc-74 IC4.3
OUT3
  Top 0.254: IC2.16 31.77,51.45 arc43 33.34,52.07 arc-44 IC4.2
OUT4
  Top 0.254: IC2.17 31.32,51.95 arc63 33.34,53.18 arc-54 34.45,53.98 IC4.1
RF433  (via drill 0.5)
  Top 0.254: IC2.40 13.36,53.95 arc21 v11.75,53.66 | R10.1 arc-8 19.05,81.92 arc-31 v18.57,81.12
  Bottom 0.254: v11.75,53.66 arc-8 9.21,59.05 arc-42 9.21,61.59 arc21 10.16,66.67 10.16,69.22 arc53 8.89,71.75 arc-53 7.62,74.3 7.62,75.88 arc-49 8.26,77.47 arc-48 v18.57,81.12
RF433OUT  (via drill 0.5)
  Top 0.254: IC2.29 26.15,62.34 arc-28 v26.51,63.82 arc-35 TP2.PP
  Bottom 0.254: JP2.3 arc75 13.97,83.82 arc20 18.1,83.19 arc-34 20.32,82.55 arc-4 26.67,78.11 arc-53 28.26,74.93 28.26,69.22 arc-36 v26.51,63.82
SCL1
  Top 0.254: R5.1 14.61,42.55 arc90 16.51,44.45 IC1.6 arc38 16.51,46.35 arc52 15.88,46.99 arc-71 12.7,51.44 arc-90 14.22,52.95 IC2.42
SDA1
  Top 0.254: R4.1 arc-43 14.61,41.91 arc88 IC1.5 | IC2.43 14.36,52.45 arc90 13.34,51.44 arc67 15.88,47.62 arc-63 IC1.5 | IC1.5 17.78,45.72
SPI2_MISO
  Top 0.254: IC2.27 27.15,60.96 arc-57 28.57,63.5 arc58 33.66,72.71 33.66,75.25 arc-90 35.24,76.83 arc82 37.47,79.38 37.47,81.28 arc-37 SV1.7
SPI2_MOSI
  Top 0.254: IC2.28 26.65,61.59 arc-55 27.94,63.82 arc58 33.02,73.03 33.02,75.56 arc-90 34.92,77.47 arc90 36.83,79.38 36.83,83.82 arc-67 SV1.8
SPI2_SCK
  Top 0.254: IC2.26 27.65,60.96 arc-52 28.89,62.87 arc59 34.29,72.39 34.29,75.25 arc-78 35.24,76.2 arc84 38.1,79.38 arc-67 SV1.9
SWCLK
  Top 0.254: IC2.37 20.11,55.45 arc-90 19.05,56.52 19.05,60.96 arc28 JP1.3
SWDIO
  Top 0.254: IC2.34 23.65,60.49 arc90 22.23,61.91 arc-83 JP1.2
TAMPER
  Top 0.254: IC2.2 23.15,46.65 arc-21 22.86,45.09 arc-85 TP1.PP
U1_RX
  Top 0.254: SV1.4 33.02,85.09 arc-42 32.38,84.3 arc59 31.75,83.19 31.75,73.03 arc-73 26.99,66.67 arc73 25.15,64.2 IC2.31
U1_TX
  Top 0.254: IC2.30 25.65,63.75 arc-72 27.3,66.04 arc71 32.38,73.03 32.38,81.28 arc-37 SV1.3
U3_CK
  Top 0.254: IC2.25 28.15,60.33 arc-55 29.53,62.55 arc59 34.92,72.07 34.92,74.93 arc-69 35.56,75.56 arc80 38.73,79.38 arc-82 40.96,81.92 arc82 41.91,82.87 41.91,83.19 arc53 SV1.10 arc53 35.56,88.27 27.3,88.27 arc72 R14.1
U3_RX  (via drill 0.5)
  Top 0.254: IC2.22 30.32,54.45 arc90 31.11,55.24 arc-44 32.38,58.42 arc25 v34.29,61.59 | R13.1 arc-88 27.3,87.63 33.66,87.63 arc-90 SV1.6
  Bottom 0.254: v34.29,61.59 34.29,83.19 arc-53 SV1.6
U3_TX  (via drill 0.5)
  Top 0.254: IC2.21 30.46,53.95 arc90 31.75,55.24 arc-43 32.86,58.1 arc-1 v35.24,60.64
  Top 0.406: R12.1 35.05,79.5 arc-16 SV1.5
  Bottom 0.254: SV1.5 arc28 34.92,80.64 34.92,62.87 arc23 35.08,62.07 arc-23 35.24,61.28 v35.24,60.64
USB_DISC  (via drill 0.5)
  Top 0.254: IC2.11 27.65,49.19 arc27 v27.3,50.64 | R18.1 21.08,70.61 v20.95,70.48
  Bottom 0.254: v20.95,70.48 arc28 20.32,67.94 arc-90 18.41,66.04 15.88,66.04 arc90 12.7,62.87 arc90 22.23,53.34 arc-56 v27.3,50.64
USB_DM
  Top 0.254: C19.1 R30.1 arc29 20.95,78.11 24.13,78.11 arc-90 26.04,76.2 26.04,67.47 arc-48 25.72,66.67 arc46 24.65,64.14 IC2.32
USB_DP
  Top 0.254: 22.86,77.47 24.13,77.47 arc-90 25.4,76.2 25.4,67.79 arc-40 25.08,66.83 arc38 24.15,64.16 IC2.33 | 22.86,77.47 R29.1 C20.1 | R20.1 22.73,77.34 22.86,77.47
USB_P  (via drill 0.5)
  Top 0.254: IC2.10 27.15,49.05 arc77 v26.51,49.85
  Top 0.406: R21.2 v19.05,67.31 R22.2
  Bottom 0.254: v19.05,67.31 arc-37 17.14,66.67 15.88,66.67 arc90 12.06,62.87 arc90 22.23,52.7 arc-67 v26.51,49.85
VBAT  (via drill 0.5)
  Top 0.254: IC2.1 22.65,48.05 arc-28 v22.23,45.72
  Bottom 0.254: v22.23,45.72 arc90 18.41,41.91 18.41,35.56 arc-80 G1.+
VBUS
  Top 0.406: R21.1 R16.2 15.24,69.22 arc-91 12.14,72.39 USB1.VBUS
XTAL2
  Top 0.254: C6.2 27.56,40.13 Z2.1 arc-54 25.15,44.06 IC2.6
  Bottom 0.254: Z2.1 R6.1

### Text on the board
Bottom: Fourel automation | tuxotronic.org | Rev.A (2.05.2013)
tPlace: NC | A4 | N | NO | NC | A3 | N | NO | NC | A2 | N | NO | NC | A1 | N | NO | A | N | Order #100011640
bPlace: GND | +3.3V | TX1 | RX1 | TX3/SCL2 | RX3/SDA2 | MISO2 | MOSI2 | SCK2 | CK3